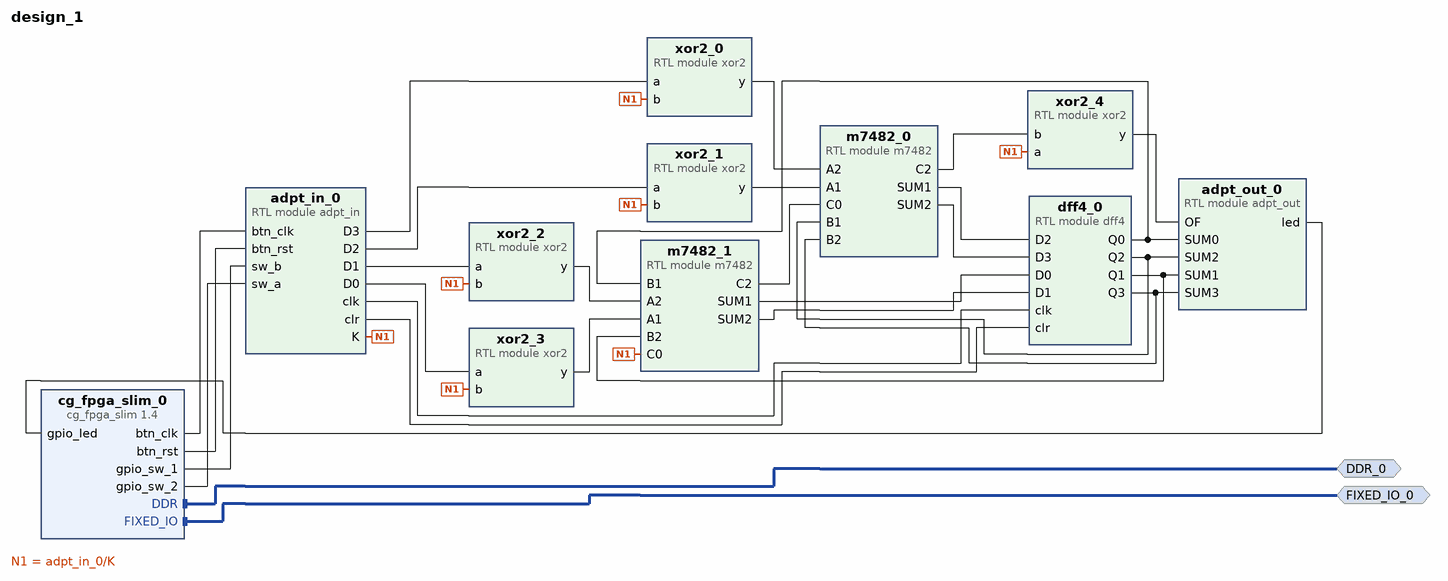
[diagram p0: block diagram of the top level]
# Vivado block design design_1, xc7z020clg400-1, Vivado 2024.2
create_bd_design design_1

create_bd_intf_port -mode Master -vlnv xilinx.com:interface:ddrx_rtl:1.0 DDR_0
create_bd_intf_port -mode Master -vlnv xilinx.com:display_processing_system7:fixedio_rtl:1.0 FIXED_IO_0

create_bd_cell -type ip -vlnv educg.net:user:cg_fpga_slim:1.4 cg_fpga_slim_0
create_bd_cell -type module -reference adpt_in adpt_in_0
create_bd_cell -type module -reference adpt_out adpt_out_0
create_bd_cell -type module -reference dff4 dff4_0
create_bd_cell -type module -reference m7482 m7482_0
create_bd_cell -type module -reference xor2 xor2_0
create_bd_cell -type module -reference xor2 xor2_1
create_bd_cell -type module -reference xor2 xor2_2
create_bd_cell -type module -reference xor2 xor2_3
create_bd_cell -type module -reference xor2 xor2_4
create_bd_cell -type module -reference m7482 m7482_1

# ---- connections ----

connect_bd_intf_net [get_bd_intf_ports DDR_0] [get_bd_intf_pins cg_fpga_slim_0/DDR]
connect_bd_intf_net [get_bd_intf_ports FIXED_IO_0] [get_bd_intf_pins cg_fpga_slim_0/FIXED_IO]
connect_bd_net [get_bd_pins adpt_in_0/D0] [get_bd_pins xor2_3/a]
connect_bd_net [get_bd_pins adpt_in_0/D1] [get_bd_pins xor2_2/a]
connect_bd_net [get_bd_pins adpt_in_0/D2] [get_bd_pins xor2_1/a]
connect_bd_net [get_bd_pins adpt_in_0/D3] [get_bd_pins xor2_0/a]
connect_bd_net [get_bd_pins adpt_in_0/K] \
  [get_bd_pins xor2_0/b] [get_bd_pins xor2_1/b] [get_bd_pins xor2_2/b] [get_bd_pins xor2_3/b] [get_bd_pins m7482_1/C0] \
  [get_bd_pins xor2_4/a]
connect_bd_net [get_bd_pins adpt_in_0/clk] [get_bd_pins dff4_0/clk]
connect_bd_net [get_bd_pins adpt_in_0/clr] [get_bd_pins dff4_0/clr]
connect_bd_net [get_bd_pins adpt_out_0/led] [get_bd_pins cg_fpga_slim_0/gpio_led]
connect_bd_net [get_bd_pins cg_fpga_slim_0/btn_clk] [get_bd_pins adpt_in_0/btn_clk]
connect_bd_net [get_bd_pins cg_fpga_slim_0/btn_rst] [get_bd_pins adpt_in_0/btn_rst]
connect_bd_net [get_bd_pins cg_fpga_slim_0/gpio_sw_1] [get_bd_pins adpt_in_0/sw_b]
connect_bd_net [get_bd_pins cg_fpga_slim_0/gpio_sw_2] [get_bd_pins adpt_in_0/sw_a]
connect_bd_net [get_bd_pins dff4_0/Q0] [get_bd_pins m7482_1/B1] [get_bd_pins adpt_out_0/SUM0]
connect_bd_net [get_bd_pins dff4_0/Q1] [get_bd_pins m7482_1/B2] [get_bd_pins adpt_out_0/SUM1]
connect_bd_net [get_bd_pins dff4_0/Q2] [get_bd_pins m7482_0/B1] [get_bd_pins adpt_out_0/SUM2]
connect_bd_net [get_bd_pins dff4_0/Q3] [get_bd_pins m7482_0/B2] [get_bd_pins adpt_out_0/SUM3]
connect_bd_net [get_bd_pins m7482_0/C2] [get_bd_pins xor2_4/b]
connect_bd_net [get_bd_pins m7482_0/SUM1] [get_bd_pins dff4_0/D2]
connect_bd_net [get_bd_pins m7482_0/SUM2] [get_bd_pins dff4_0/D3]
connect_bd_net [get_bd_pins m7482_1/C2] [get_bd_pins m7482_0/C0]
connect_bd_net [get_bd_pins m7482_1/SUM1] [get_bd_pins dff4_0/D0]
connect_bd_net [get_bd_pins m7482_1/SUM2] [get_bd_pins dff4_0/D1]
connect_bd_net [get_bd_pins xor2_0/y] [get_bd_pins m7482_0/A2]
connect_bd_net [get_bd_pins xor2_1/y] [get_bd_pins m7482_0/A1]
connect_bd_net [get_bd_pins xor2_2/y] [get_bd_pins m7482_1/A2]
connect_bd_net [get_bd_pins xor2_3/y] [get_bd_pins m7482_1/A1]
connect_bd_net [get_bd_pins xor2_4/y] [get_bd_pins adpt_out_0/OF]

validate_bd_design
save_bd_design
